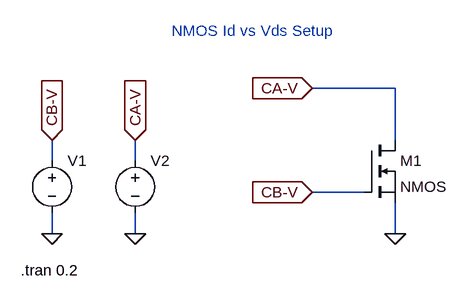
[diagram p0: schematic nmos_id_vs_vds_ltspice.asc]
nmos_id_vs_vds_ltspice.asc, the LTspice schematic file:
Version 4
SHEET 1 3404 680
WIRE 176 32 48 32
WIRE 176 112 176 32
WIRE -352 144 -352 112
WIRE -224 144 -224 112
WIRE 128 192 48 192
WIRE -352 256 -352 224
WIRE -224 256 -224 224
WIRE 176 256 176 208
FLAG 176 256 0
FLAG 48 32 CA-V
IOPIN 48 32 In
FLAG 48 192 CB-V
IOPIN 48 192 In
FLAG -352 256 0
FLAG -224 256 0
FLAG -352 112 CB-V
IOPIN -352 112 In
FLAG -224 112 CA-V
IOPIN -224 112 In
SYMBOL nmos 128 112 R0
SYMATTR InstName M1
SYMBOL voltage -352 128 R0
WINDOW 3 9 105 Invisible 2
WINDOW 123 0 0 Left 0
WINDOW 39 0 0 Left 0
SYMATTR InstName V1
SYMATTR Value PWL REPEAT FOREVER(0 1.25 5m 1.25 5.0001m 1.55 10m 1.55 10.0001m 1.85 15m 1.85 15.0001m 2.15 20m 2.15 20.0001m 2.45 25m 2.45 25.0001m 2.75 30m 2.75 30.0001m 3.05 35m 3.05 35.0001m 3.35 40m 3.35 40.0001m 3.65 45m 3.65 45.0001m 3.95 50m 3.95 50.0001m 4.25 55m 4.25 55.0001m 1.25) ENDREPEAT
SYMBOL voltage -224 128 R0
WINDOW 3 24 44 Invisible 2
SYMATTR InstName V2
SYMATTR Value PWL REPEAT FOREVER(0 2.75 1.25m 4.5 2.55m 2.75 3.75m 1 5m 2.75) ENDREPEAT
TEXT -168 -56 Left 2 ;NMOS Id vs Vds Setup
TEXT -400 312 Left 2 !.tran 0.2

The netlist it stands for:
* nmos_id_vs_vds_ltspice.asc
M1 CA-V CB-V 0 0 NMOS
V1 CB-V 0 PWL REPEAT FOREVER(0 1.25 5m 1.25 5.0001m 1.55 10m 1.55 10.0001m 1.85 15m 1.85 15.0001m 2.15 20m 2.15 20.0001m 2.45 25m 2.45 25.0001m 2.75 30m 2.75 30.0001m 3.05 35m 3.05 35.0001m 3.35 40m 3.35 40.0001m 3.65 45m 3.65 45.0001m 3.95 50m 3.95 50.0001m 4.25 55m 4.25 55.0001m 1.25) ENDREPEAT
V2 CA-V 0 PWL REPEAT FOREVER(0 2.75 1.25m 4.5 2.55m 2.75 3.75m 1 5m 2.75) ENDREPEAT
.model NMOS NMOS
.model PMOS PMOS
.lib standard.mos
* NMOS Id vs Vds Setup
.tran 0.2
.backanno
.end